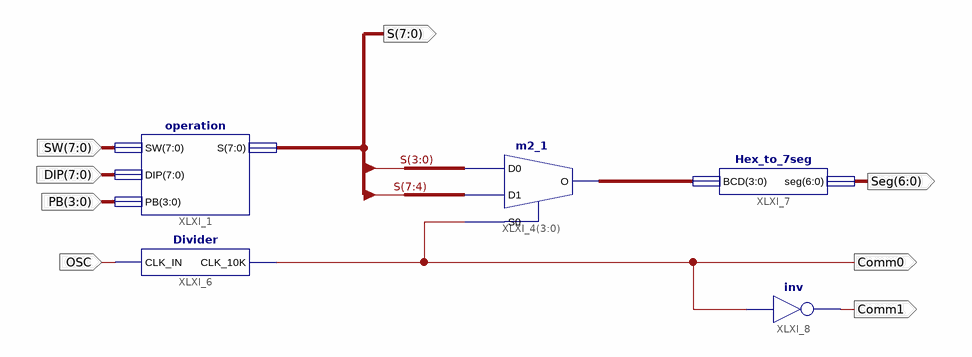
[diagram p0: schematic sheet 1]
// Xilinx ISE schematic main.sch (spartan6) as structural Verilog: 5 symbols, 8 ports
module main (
  input  [7:0] SW,
  input  [7:0] DIP,
  input  [3:0] PB,
  input  OSC,
  output [7:0] S,
  output Comm0,
  output [6:0] Seg,
  output Comm1
);

  wire [3:0] XLXN_26;

  operation XLXI_1 (.SW(SW), .DIP(DIP), .PB(PB), .S(S));
  m2_1 XLXI_4[3:0] (.D0(S[3:0]), .D1(S[7:4]), .S0(Comm0), .O(XLXN_26));
  Divider XLXI_6 (.CLK_IN(OSC), .CLK_10K(Comm0));
  Hex_to_7seg XLXI_7 (.BCD(XLXN_26), .seg(Seg));
  not XLXI_8 (Comm1, Comm0);

  // Notes on the sheet:
  //   LOC on signal SW(7:0) = P55,P56,P57,P58,P59,P61,P62,P66
  //   LOC on signal DIP(7:0) = P112,P111,P105,P104,P102,P101,P100,P99
  //   LOC on signal PB(3:0) = P48,P47,P46,p45
  //   LOC on signal S(7:0) = P67,P74,P75,P78,P79,P80,P81,P82
  //   LOC on signal OSC = P123
  //   LOC on signal Comm0 = P44
  //   LOC on signal Seg(6:0) = P27,P29,P32,P34,P35,P40,P41
  //   LOC on signal Comm1 = P43
endmodule
